# Altium project GE3.0.PrjPcb
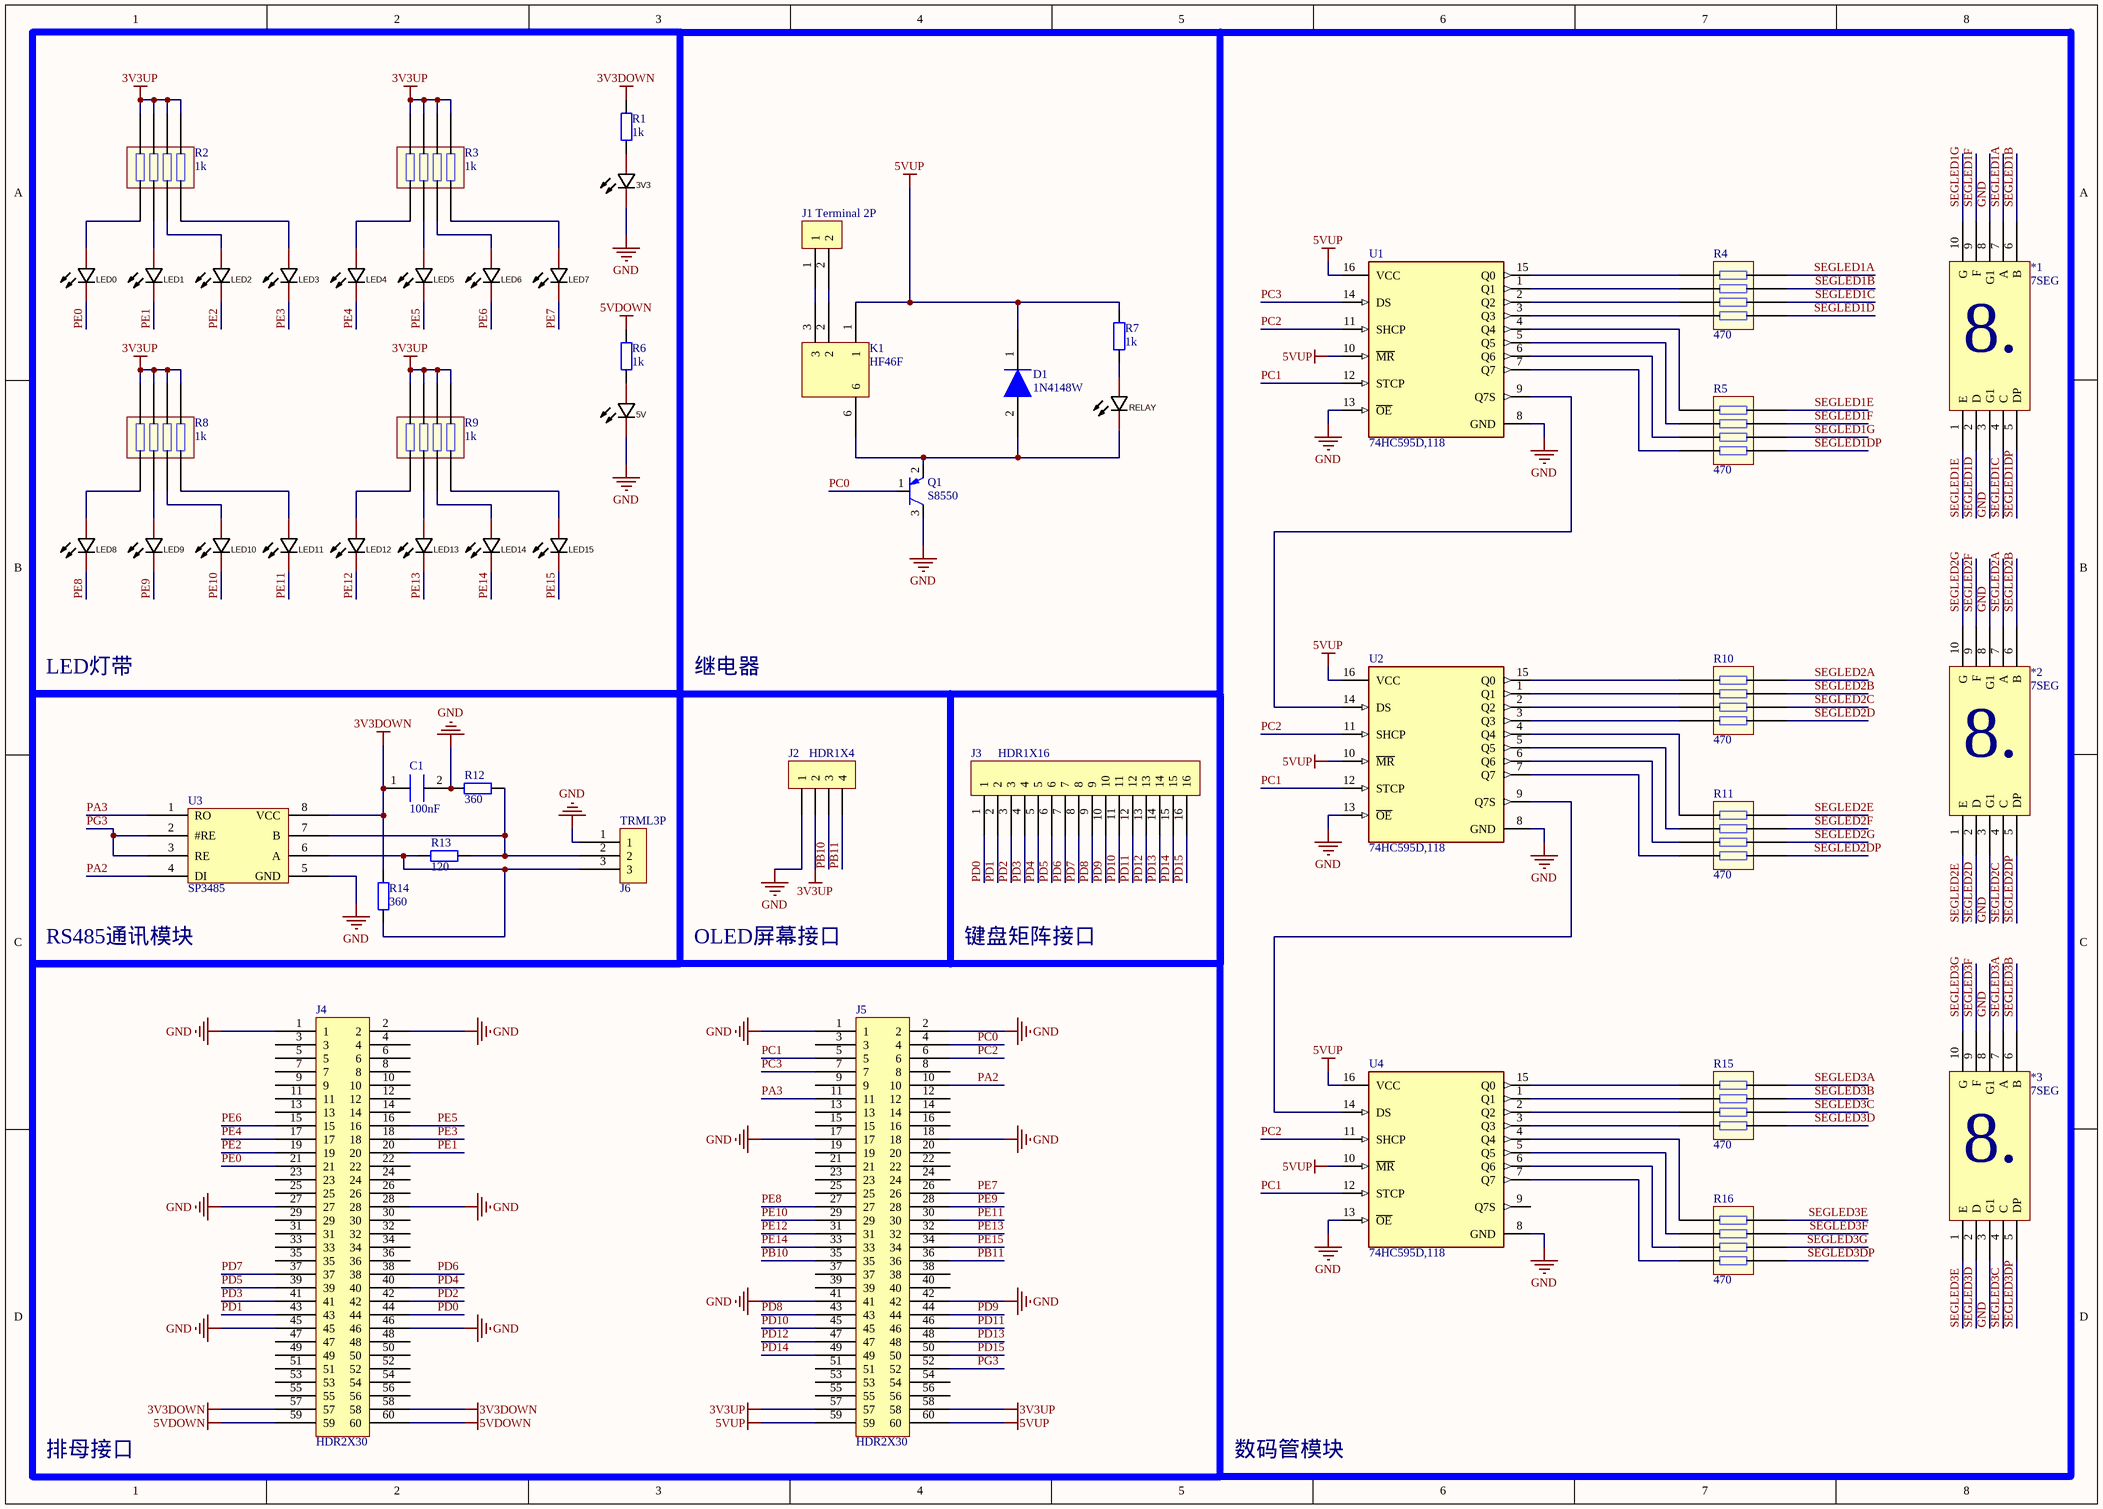
[diagram p0: GE3.0.SchDoc]
1 sheet, 52 parts. Net scope: global (net labels, ports and power ports of the same name join across sheets).
Board file: GE3.0.PcbDoc

## Sheet GE3.0.SchDoc
size A3

### Parts
3V3  NCD0603R1_C84263  [LED0603-RD_RED]  (value not drawn)
5V  NCD0603R1_C84263  [LED0603-RD_RED]  (value not drawn)
*1  7SEG  [SM410561N]
*2  7SEG  [SM410561N]
*3  7SEG  [SM410561N]
C1  100nF  [0805C]
D1  1N4148W  [SOD-123_L2.8-W1.8-LS3.7-RD]
J1  Terminal 2P  [TRML2P]
J2  HDR1X4  [HDR1X4]
J3  HDR1X16  [HDR1X16]
J4  HDR2X30  [HDR2x30]
J5  HDR2X30  [HDR2x30]
K1  HF46F  [RELAY-TH_HF46F-5-HS1T]
LED0  NCD0603R1_C84263  [LED0603-RD_RED]  (value not drawn)
LED1  NCD0603R1_C84263  [LED0603-RD_RED]  (value not drawn)
LED2  NCD0603R1_C84263  [LED0603-RD_RED]  (value not drawn)
LED3  NCD0603R1_C84263  [LED0603-RD_RED]  (value not drawn)
LED4  NCD0603R1_C84263  [LED0603-RD_RED]  (value not drawn)
LED5  NCD0603R1_C84263  [LED0603-RD_RED]  (value not drawn)
LED6  NCD0603R1_C84263  [LED0603-RD_RED]  (value not drawn)
LED7  NCD0603R1_C84263  [LED0603-RD_RED]  (value not drawn)
LED8  NCD0603R1_C84263  [LED0603-RD_RED]  (value not drawn)
LED9  NCD0603R1_C84263  [LED0603-RD_RED]  (value not drawn)
LED10  NCD0603R1_C84263  [LED0603-RD_RED]  (value not drawn)
LED11  NCD0603R1_C84263  [LED0603-RD_RED]  (value not drawn)
LED12  NCD0603R1_C84263  [LED0603-RD_RED]  (value not drawn)
LED13  NCD0603R1_C84263  [LED0603-RD_RED]  (value not drawn)
LED14  NCD0603R1_C84263  [LED0603-RD_RED]  (value not drawn)
LED15  NCD0603R1_C84263  [LED0603-RD_RED]  (value not drawn)
Q1  S8550  [SOT-23-3_L2.9-W1.6-P1.90-LS2.8-BR]
R1  1k  [0603R]
R2  1k  [RES-ARRAY-SMD_0603-8P-L3.2-W1.6-BL]
R3  1k  [RES-ARRAY-SMD_0603-8P-L3.2-W1.6-BL]
R4  470  [RES-ARRAY-SMD_0603-8P-L3.2-W1.6-BL]
R5  470  [RES-ARRAY-SMD_0603-8P-L3.2-W1.6-BL]
R6  1k  [0603R]
R7  1k  [0603R]
R8  1k  [RES-ARRAY-SMD_0603-8P-L3.2-W1.6-BL]
R9  1k  [RES-ARRAY-SMD_0603-8P-L3.2-W1.6-BL]
R10  470  [RES-ARRAY-SMD_0603-8P-L3.2-W1.6-BL]
R11  470  [RES-ARRAY-SMD_0603-8P-L3.2-W1.6-BL]
R12  360  [0603R]
R13  120  [0603R]
R14  360  [0603R]
R15  470  [RES-ARRAY-SMD_0603-8P-L3.2-W1.6-BL]
R16  470  [RES-ARRAY-SMD_0603-8P-L3.2-W1.6-BL]
RELAY  NCD0603R1_C84263  [LED0603-RD_RED]  (value not drawn)
TRML3P  J6  [TRML3P]
U1  74HC595D,118  [FP-SOT109-1-IPC_C]
U2  74HC595D,118  [FP-SOT109-1-IPC_C]
U3  SP3485  [SP3485]
U4  74HC595D,118  [FP-SOT109-1-IPC_C]

### Blocks framed on the sheet
LED灯带: 3V3 5V LED0-LED15 R1-R3 R6 R8 R9
数码管模块: *1-*3 R4 R5 R10 R11 R15 R16 U1 U2 U4

### Nets
3V3DOWN: C1.1 J4.57 J4.58 R1.2 R14.1 U3.8(VCC)
3V3UP: J2.2 J5.57 J5.58 R2.5 R2.6 R2.7 R2.8 R3.5 R3.6 R3.7 R3.8 R8.5 R8.6 R8.7 R8.8 R9.5 R9.6 R9.7 R9.8
5VDOWN: J4.59 J4.60 R6.2
5VUP: D1.1 J5.59 J5.60 K1.1 R7.2 U1.10(~{MR}) U1.16(VCC) U2.10(~{MR}) U2.16(VCC) U4.10(~{MR}) U4.16(VCC)
GND: 3V3.1(K) 5V.1(K) *1.3(G1) *1.8(G1) *2.3(G1) *2.8(G1) *3.3(G1) *3.8(G1) C1.2 J2.1 J4.1 J4.2 J4.27 J4.28 J4.45 J4.46 J5.1 J5.2 J5.17 J5.18 J5.41 J5.42 Q1.3 R12.2 TRML3P.1 U1.8(GND) U1.13(~{OE}) U2.8(GND) U2.13(~{OE}) U3.5(GND) U4.8(GND) U4.13(~{OE})
PA2: J5.10 U3.4(DI)
PA3: J5.11 U3.1(RO)
PB10: J2.3 J5.35
PB11: J2.4 J5.36
PC0: J5.4 Q1.1
PC1: J5.5 U1.12(STCP) U2.12(STCP) U4.12(STCP)
PC2: J5.6 U1.11(SHCP) U2.11(SHCP) U4.11(SHCP)
PC3: J5.7 U1.14(DS)
PD0: J3.1 J4.44
PD1: J3.2 J4.43
PD2: J3.3 J4.42
PD3: J3.4 J4.41
PD4: J3.5 J4.40
PD5: J3.6 J4.39
PD6: J3.7 J4.38
PD7: J3.8 J4.37
PD8: J3.9 J5.43
PD9: J3.10 J5.44
PD10: J3.11 J5.45
PD11: J3.12 J5.46
PD12: J3.13 J5.47
PD13: J3.14 J5.48
PD14: J3.15 J5.49
PD15: J3.16 J5.50
PE0: J4.21 LED0.1(K)
PE1: J4.20 LED1.1(K)
PE2: J4.19 LED2.1(K)
PE3: J4.18 LED3.1(K)
PE4: J4.17 LED4.1(K)
PE5: J4.16 LED5.1(K)
PE6: J4.15 LED6.1(K)
PE7: J5.26 LED7.1(K)
PE8: J5.27 LED8.1(K)
PE9: J5.28 LED9.1(K)
PE10: J5.29 LED10.1(K)
PE11: J5.30 LED11.1(K)
PE12: J5.31 LED12.1(K)
PE13: J5.32 LED13.1(K)
PE14: J5.33 LED14.1(K)
PE15: J5.34 LED15.1(K)
PG3: J5.52 U3.2(#RE) U3.3(RE)
SEGLED1A: *1.7(A) R4.5
SEGLED1B: *1.6(B) R4.6
SEGLED1C: *1.4(C) R4.7
SEGLED1D: *1.2(D) R4.8
SEGLED1DP: *1.5(DP) R5.8
SEGLED1E: *1.1(E) R5.5
SEGLED1F: *1.9(F) R5.6
SEGLED1G: *1.10(G) R5.7
SEGLED2A: *2.7(A) R10.5
SEGLED2B: *2.6(B) R10.6
SEGLED2C: *2.4(C) R10.7
SEGLED2D: *2.2(D) R10.8
SEGLED2DP: *2.5(DP) R11.8
SEGLED2E: *2.1(E) R11.5
SEGLED2F: *2.9(F) R11.6
SEGLED2G: *2.10(G) R11.7
SEGLED3A: *3.7(A) R15.5
SEGLED3B: *3.6(B) R15.6
SEGLED3C: *3.4(C) R15.7
SEGLED3D: *3.2(D) R15.8
SEGLED3DP: *3.5(DP) R16.8
SEGLED3E: *3.1(E) R16.5
SEGLED3F: *3.9(F) R16.6
SEGLED3G: *3.10(G) R16.7
Net3V3_2: 3V3.2(A) R1.1
Net5V_2: 5V.2(A) R6.1
NetD1_2: D1.2 K1.6 Q1.2 RELAY.1(K)
NetJ1_1: J1.1 K1.3
NetJ1_2: J1.2 K1.2
NetLED0_2: LED0.2(A) R2.1
NetLED1_2: LED1.2(A) R2.2
NetLED2_2: LED2.2(A) R2.3
NetLED3_2: LED3.2(A) R2.4
NetLED4_2: LED4.2(A) R3.1
NetLED5_2: LED5.2(A) R3.2
NetLED6_2: LED6.2(A) R3.3
NetLED7_2: LED7.2(A) R3.4
NetLED8_2: LED8.2(A) R8.1
NetLED9_2: LED9.2(A) R8.2
NetLED10_2: LED10.2(A) R8.3
NetLED11_2: LED11.2(A) R8.4
NetLED12_2: LED12.2(A) R9.1
NetLED13_2: LED13.2(A) R9.2
NetLED14_2: LED14.2(A) R9.3
NetLED15_2: LED15.2(A) R9.4
NetR4_1: R4.1 U1.3(Q3)
NetR4_2: R4.2 U1.2(Q2)
NetR4_3: R4.3 U1.1(Q1)
NetR4_4: R4.4 U1.15(Q0)
NetR5_1: R5.1 U1.7(Q7)
NetR5_2: R5.2 U1.6(Q6)
NetR5_3: R5.3 U1.5(Q5)
NetR5_4: R5.4 U1.4(Q4)
NetR7_1: R7.1 RELAY.2(A)
NetR10_1: R10.1 U2.3(Q3)
NetR10_2: R10.2 U2.2(Q2)
NetR10_3: R10.3 U2.1(Q1)
NetR10_4: R10.4 U2.15(Q0)
NetR11_1: R11.1 U2.7(Q7)
NetR11_2: R11.2 U2.6(Q6)
NetR11_3: R11.3 U2.5(Q5)
NetR11_4: R11.4 U2.4(Q4)
NetR12_1: R12.1 R13.1 TRML3P.2 U3.7(B)
NetR13_2: R13.2 R14.2 TRML3P.3 U3.6(A)
NetR15_1: R15.1 U4.3(Q3)
NetR15_2: R15.2 U4.2(Q2)
NetR15_3: R15.3 U4.1(Q1)
NetR15_4: R15.4 U4.15(Q0)
NetR16_1: R16.1 U4.7(Q7)
NetR16_2: R16.2 U4.6(Q6)
NetR16_3: R16.3 U4.5(Q5)
NetR16_4: R16.4 U4.4(Q4)
NetU1_9: U1.9(Q7S) U2.14(DS)
NetU2_9: U2.9(Q7S) U4.14(DS)

Not connected (* = marked no-connect by the designer): J4 3 4 5 6 7 8 9 10 11 12 13 14 22 23 24 25 26 29 30 31 32 33 34 35 36 47 48 49 50 51 52 53 54 55 56; J5 3 8 9 12 13 14 15 16 19 20 21 22 23 24 25 37 38 39 40 51 53 54 55 56; U4 9(Q7S)

### Notes on the sheet
- 继电器
- RS485通讯模块
- OLED屏幕接口
- 键盘矩阵接口
- 排母接口
- (in symbol 7SEG) 8.

### Library data of the parts
3V3 5V LED0-LED15 = NCD0603R1_C84263: Manufacturer: 国星光电; Symbol: FC-DA1608HRK-620D; Add into BOM: yes; Emitted Color: 红灯; Name: NCD0603R1; Device: NCD0603R1_C84263; LCSC Part Name: 红灯; Supplier Part: C84263; Manufacturer Part: NCD0603R1; Supplier Footprint: 0603; JLCPCB Part Class: Extended Part; Datasheet: https://atta.szlcsc.com/upload/public/pdf/source/20200820/C84263_DABC6A75E58F576973B407FDBA283D60.pdf; Supplier: LCSC; Convert to PCB: yes
*1-*3 = 7SEG: 一位数码管
C1 = CAP: 电容
D1 = 1N4148W: 二极管
J1 = TRML2P: 2P接线端子
J2 = HDR1X4: Connector
K1 = HF46F: 5V一路继电器宏发C5252509 / https://item.szlcsc.com/5969785.html
Q1 = S8550: PNP
R1 R6 R7 R12-R14 = Res2: Resistor
R2-R5 R8-R11 R15 R16 = RES_ARRAY_0603
RELAY = LED_0603: Manufacturer: 国星光电; Symbol: FC-DA1608HRK-620D; Add into BOM: yes; Emitted Color: 红灯; Name: NCD0603R1; Device: NCD0603R1_C84263; LCSC Part Name: 红灯; Supplier Part: C84263; Manufacturer Part: NCD0603R1; Supplier Footprint: 0603; JLCPCB Part Class: Extended Part; Datasheet: https://atta.szlcsc.com/upload/public/pdf/source/20200820/C84263_DABC6A75E58F576973B407FDBA283D60.pdf; Supplier: LCSC; Convert to PCB: yes
TRML3P = TRML3P: 3P接线端子直针
U1 U2 U4 = CMP-14351-000006-1: IC SHIFT REGISTER 8BIT 16SOIC; RoHS Compliant: Yes